# Altium schematic sheet Receiver.SchDoc
size A4; SheetNumber: 1; SheetTotal: 2
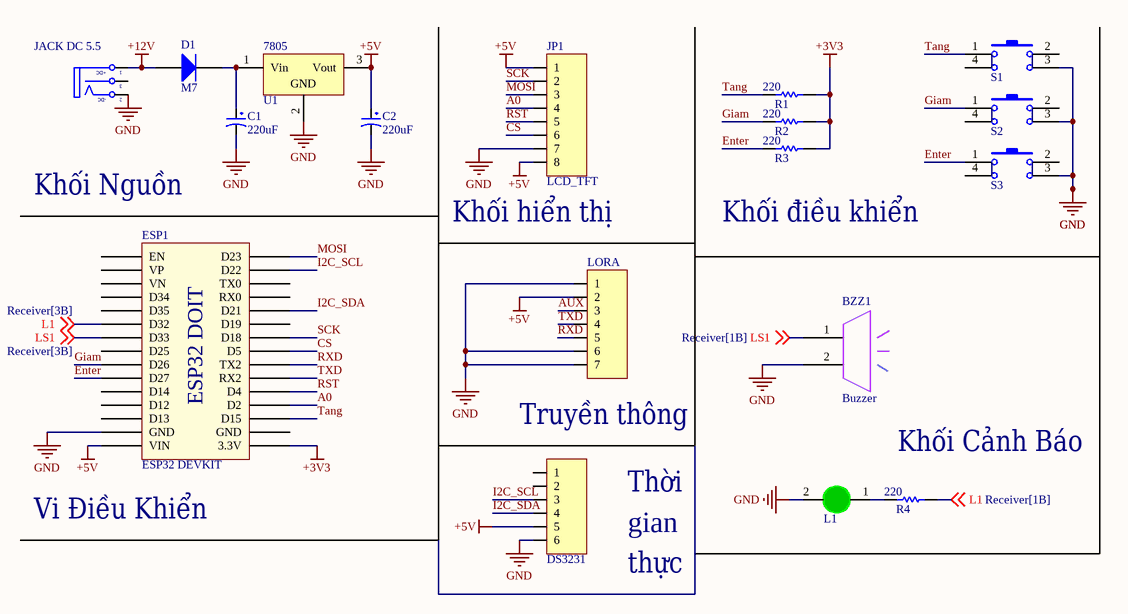
[diagram p0: Receiver.SchDoc]

## Parts
BZZ1  Buzzer  [buzzer 5V]
C1  220uF  [Tu hoa 8mm]
C2  220uF  [Tu hoa 8mm]
D1  M7  [DIODE SMA]
ESP1  ESP32 DEVKIT  [ESP32 WROOM 32 KIT]
JACK_DC1  JACK DC 5.5  [JACK DC 5.5]
JP1  LCD_TFT  [JP 1x8 CT]
JP2  LORA  [JP 1x7 CT]
JP3  DS3231  [JP 1x6 CT]
L1  LED 5mm  [LED-5MM-Green]  (value not drawn)
R1  220  [0805]
R2  220  [0805]
R3  220  [0805]
R4  220  [0805]
S1  BUTTON 4 CHAN  [BUTTON 6x6x5]  (value not drawn)
S2  BUTTON 4 CHAN  [BUTTON 6x6x5]  (value not drawn)
S3  BUTTON 4 CHAN  [BUTTON 6x6x5]  (value not drawn)
U1  7805  [D-PAK]

## Nets
+3V3: ESP1.16(3.3V) R1.2 R2.2 R3.2
+5V: C2.1 ESP1.15(VIN) JP1.1 JP1.8 JP2.2 JP3.5 U1.3(Vout)
+12V: D1.1(A) JACK_DC1.1(T)
GND: BZZ1.2 C1.2 C2.2 ESP1.14(GND) JACK_DC1.2(TN) JP1.7 JP2.1 JP2.6 JP2.7 JP3.6 L1.2(K) S1.3 S2.3 S3.3 U1.2(GND)
A0: ESP1.19(D2) JP1.4
AUX: JP2.3
CS: ESP1.23(D5) JP1.6
Enter: ESP1.10(D27) R3.1 S3.1
Giam: ESP1.9(D26) R2.1 S2.1
I2C_SCL: ESP1.29(D22) JP3.3
I2C_SDA: ESP1.26(D21) JP3.4
L1: ESP1.6(D32) R4.2 ; off-sheet L1
LS1: BZZ1.1 ESP1.7(D33) ; off-sheet LS1
MOSI: ESP1.30(D23) JP1.3
RST: ESP1.20(D4) JP1.5
RXD: ESP1.22(TX2) JP2.5
SCK: ESP1.24(D18) JP1.2
Tang: ESP1.18(D15) R1.1 S1.1
TXD: ESP1.21(RX2) JP2.4
NetC1_1: C1.1 D1.2(K) U1.1(Vin)
NetL1_1: L1.1(A) R4.1

Not connected (* = marked no-connect by the designer): ESP1 1(EN) 2(VP) 3(VN) 4(D34) 5(D35) 8(D25) 11(D14) 12(D12) 13(D13) 17(GND) 25(D19) 27(RX0) 28(TX0); JACK_DC1 3(S); JP3 1 2; S1 2 4; S2 2 4; S3 2 4

## Notes on the sheet
- Khối Nguồn
- Khối hiển thị
- Khối điều khiển
- Truyền thông
- Thời
- Khối Cảnh Báo
- (near ESP1) Vi Điều Khiển
- gian
- thực
- (in symbol ESP32 WROOM 32 KIT) ESP32 DOIT
- (in symbol JACK DC 5.5) +DC; -DC

## Library data of the parts
C1 C2 = Tu Hoa 220uF 25V 8x10: Cắm; Don_Vi: Con; So_Chan: 2; Ten_Linh_Kien: Tụ Hóa 220uF 25V 8x10MM; Ma_Hang: MH006864; Chung_Loai: Cắm; Kieu_Chan: *
D1 = Diode M7 ( 4007 ): Dán; Don_Vi: Con; Ten_Linh_Kien: Diode M7 1N4007 SMD 1A 1000V; Ma_Hang: MH000944; Chung_Loai: Dán; Ghi_Chu: *
ESP1 = ESP32 WROOM 32 KIT
JACK_DC1 = JACK DC 5.5: Value: Jac DC
JP1 = JP 1x8 2.54 Cai Thang: Cắm; Ten_Linh_Kien: Jump Đơn Cái 2.54MM 1x20P Thẳng; Don_Vi: Con; Ma_Hang: MH004006; Ghi_Chu: *; Kieu_Chan: *; Chung_Loai: Cắm
JP2 = JP 1x7 2.54 Cai Thang: Cắm; Ten_Linh_Kien: Jump Đơn Cái 2.54MM 1x20P Thẳng; Don_Vi: Con; Ma_Hang: MH004006; Ghi_Chu: *; Kieu_Chan: *; Chung_Loai: Cắm
JP3 = JP 1x6 2.54 Cai Thang: Cắm; Ten_Linh_Kien: Jump Đơn Cái 2.54MM 1x20P Thẳng; Don_Vi: Con; Ma_Hang: MH004006; Ghi_Chu: *; Kieu_Chan: *; Chung_Loai: Cắm
L1 = LED 5mm Xanh La: Cắm; Don_Vi: Con; Ma_Hang: MH008969; Ten_Linh_Kien: LED 5MM Phủ Xanh (1000c); Ghi_Chu: *; Kieu_Chan: *; Chung_Loai: Cắm
R1-R4 = DIENTRO 0.6W: Value: O.6W
U1 = 7805: Value: 7805